# Altium schematic sheet mcu.SchDoc: MCU (STM32G474VET6)
size A3; Revision: 1.0.0; SheetNumber: 7; SheetTotal: 10
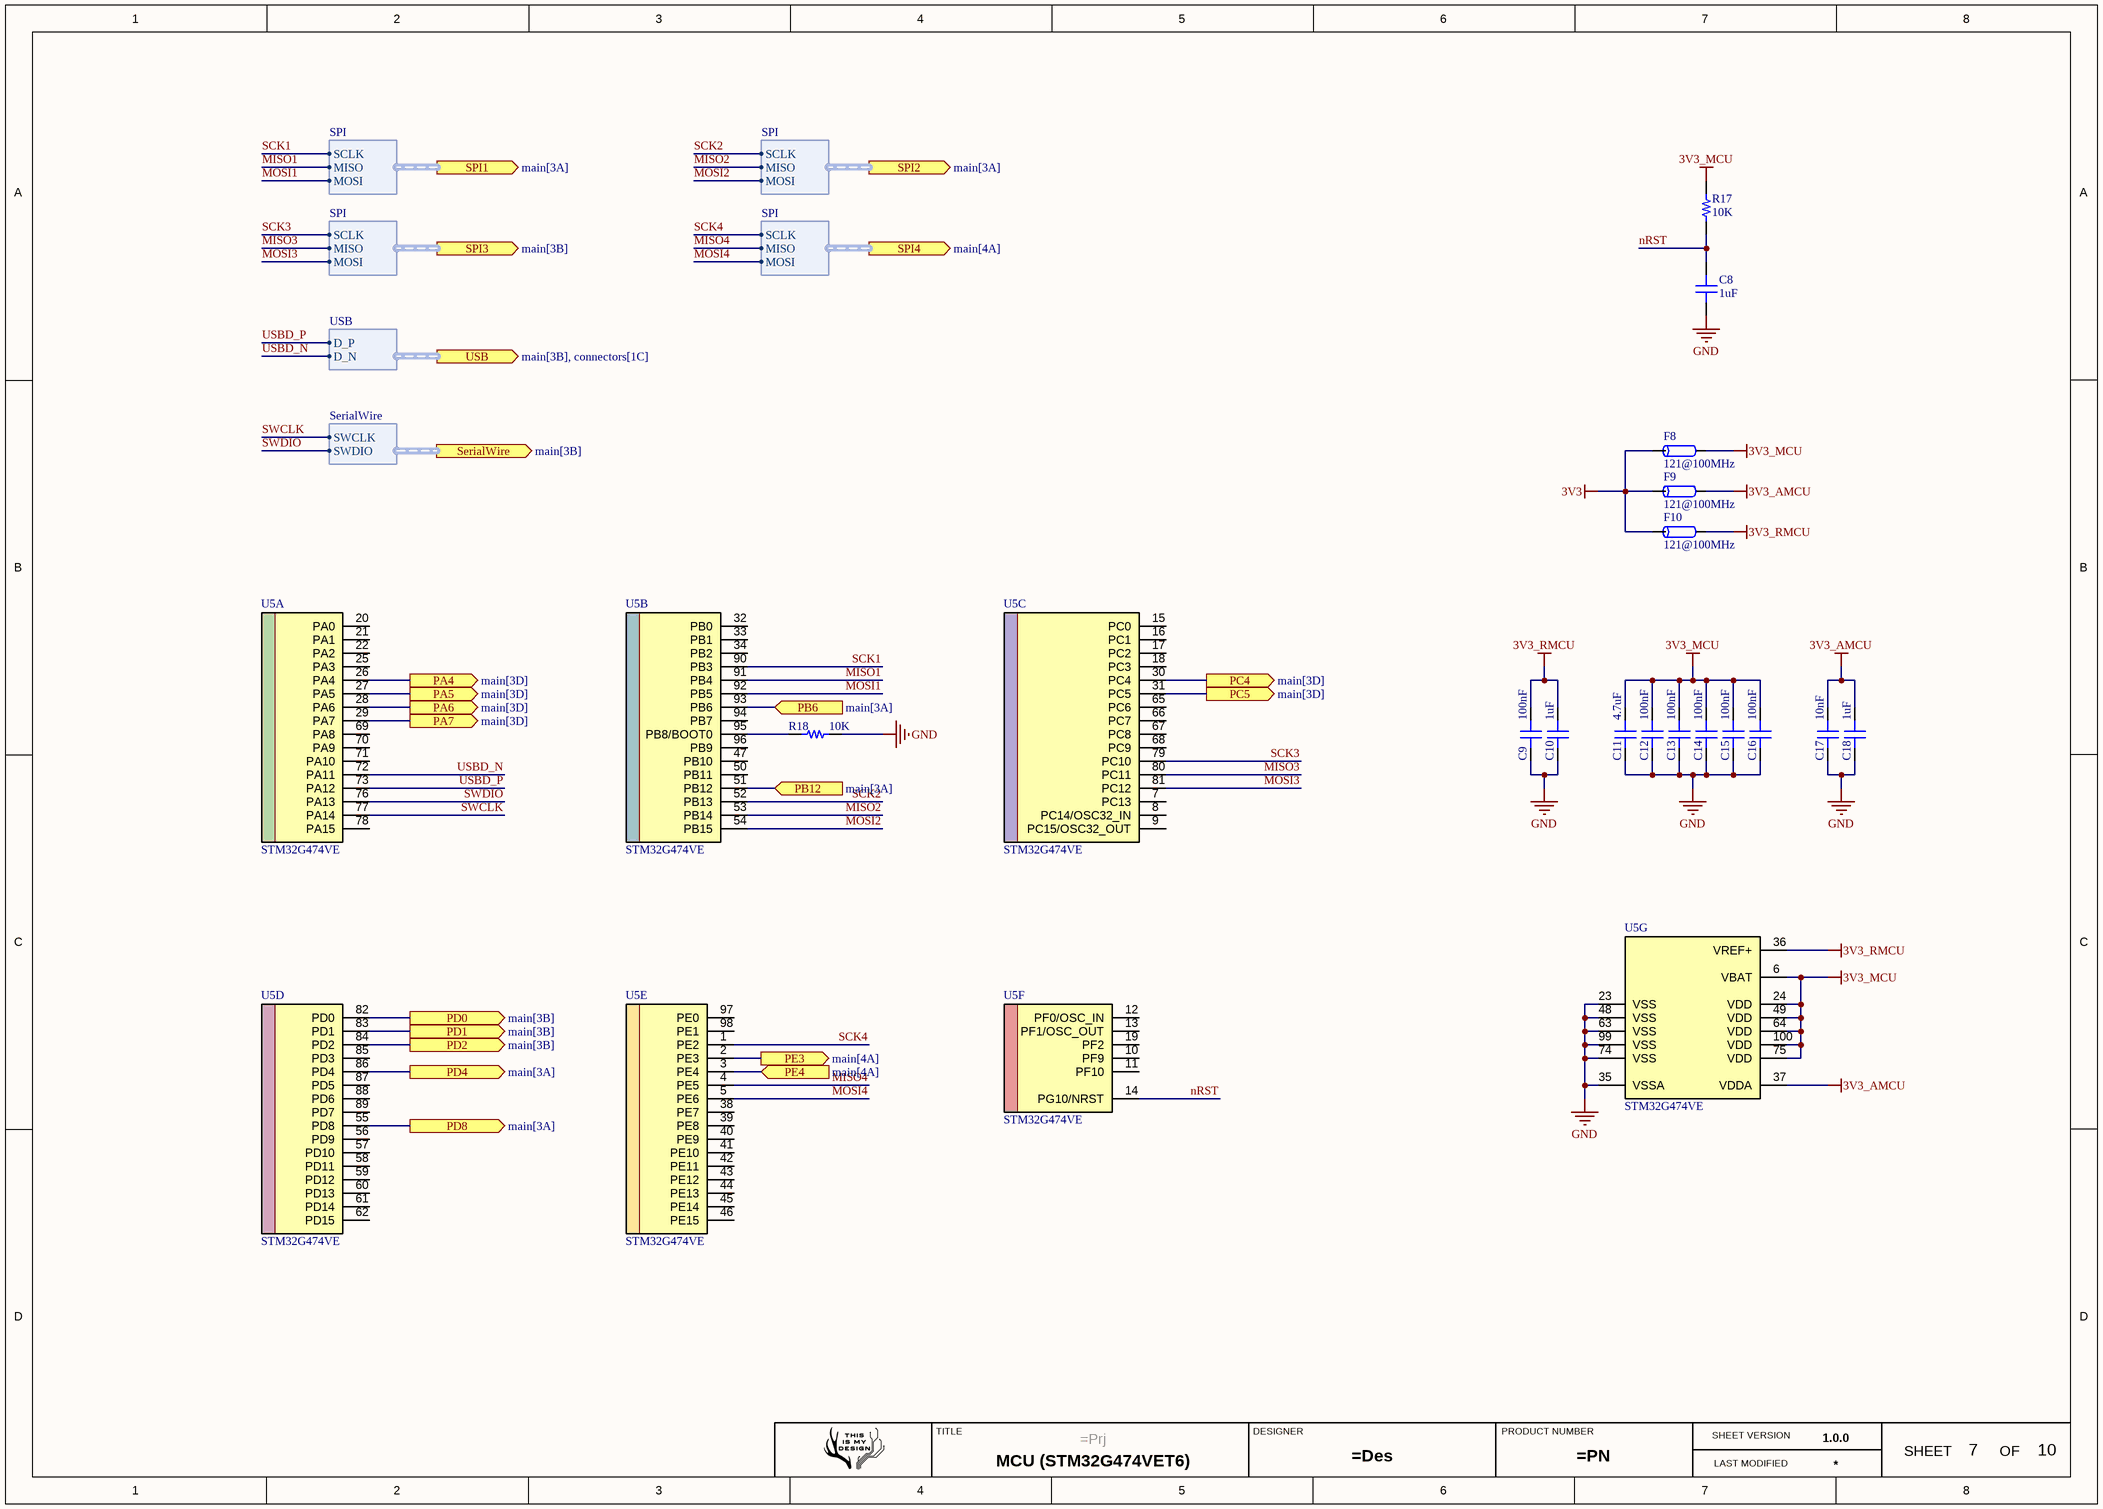
[diagram p0: mcu.SchDoc]

## Parts
C8  1uF  [CAP 0603_1608]
C9  100nF  [CAP 0603_1608]
C10  1uF  [CAP 0603_1608]
C11  4.7uF  [CAP 0805_2012]
C12  100nF  [CAP 0603_1608]
C13  100nF  [CAP 0603_1608]
C14  100nF  [CAP 0603_1608]
C15  100nF  [CAP 0603_1608]
C16  100nF  [CAP 0603_1608]
C17  10nF  [CAP 0603_1608]
C18  1uF  [CAP 0603_1608]
F8  121@100MHz  [Ferrite-0805]
F9  121@100MHz  [Ferrite-0805]
F10  121@100MHz  [Ferrite-0805]
R17  10K  [RES 0603_1608]
R18  10K  [RES 0402_1005]
U5  STM32G474VE  [LQFP100]  (parts A,B,C,D,E,F,G of 7)

## Ports
PA4 (out, see main[3D]), PA5 (out, see main[3D]), PA6 (out, see main[3D]), PA7 (out, see main[3D]), PB6 (in, see main[3A]), PB12 (in, see main[3A]), PC4 (out, see main[3D]), PC5 (out, see main[3D]), PD0 (out, see main[3B]), PD1 (out, see main[3B]), PD2 (out, see main[3B]), PD4 (out, see main[3A]), PD8 (out, see main[3A]), PE3 (out, see main[4A]), PE4 (in, see main[4A]), SerialWire (out, harness SerialWire, see main[3B]), SPI1 (out, harness SPI, see main[3A]), SPI2 (out, harness SPI, see main[3A]), SPI3 (out, harness SPI, see main[3B]), SPI4 (out, harness SPI, see main[4A]), USB (out, harness USB, see main[3B], connectors[1C])

## Harnesses
SPI: SCLK, MISO, MOSI
USB: D_P, D_N
SerialWire: SWCLK, SWDIO

## Nets
3V3: F8.2 F9.2 F10.2
3V3_AMCU: C17.2 C18.2 F9.1 U5.37(VDDA)
3V3_MCU: C11.2 C12.2 C13.2 C14.2 C15.2 C16.2 F8.1 R17.2 U5.6(VBAT) U5.24(VDD) U5.49(VDD) U5.64(VDD) U5.75(VDD) U5.100(VDD)
3V3_RMCU: C9.2 C10.2 F10.1 U5.36(VREF+)
GND: C8.1 C9.1 C10.1 C11.1 C12.1 C13.1 C14.1 C15.1 C16.1 C17.1 C18.1 R18.2 U5.23(VSS) U5.35(VSSA) U5.48(VSS) U5.63(VSS) U5.74(VSS) U5.99(VSS)
MISO1: U5.91(PB4) ; port SPI1.MISO
MISO2: U5.53(PB14) ; port SPI2.MISO
MISO3: U5.80(PC11) ; port SPI3.MISO
MISO4: U5.4(PE5) ; port SPI4.MISO
MOSI1: U5.92(PB5) ; port SPI1.MOSI
MOSI2: U5.54(PB15) ; port SPI2.MOSI
MOSI3: U5.81(PC12) ; port SPI3.MOSI
MOSI4: U5.5(PE6) ; port SPI4.MOSI
nRST: C8.2 R17.1 U5.14(PG10/NRST)
PA4: U5.26(PA4) ; port PA4
PA5: U5.27(PA5) ; port PA5
PA6: U5.28(PA6) ; port PA6
PA7: U5.29(PA7) ; port PA7
PB6: U5.93(PB6) ; port PB6
PB12: U5.51(PB12) ; port PB12
PC4: U5.30(PC4) ; port PC4
PC5: U5.31(PC5) ; port PC5
PD0: U5.82(PD0) ; port PD0
PD1: U5.83(PD1) ; port PD1
PD2: U5.84(PD2) ; port PD2
PD4: U5.86(PD4) ; port PD4
PD8: U5.55(PD8) ; port PD8
PE3: U5.2(PE3) ; port PE3
PE4: U5.3(PE4) ; port PE4
SCK1: U5.90(PB3) ; port SPI1.SCLK
SCK2: U5.52(PB13) ; port SPI2.SCLK
SCK3: U5.79(PC10) ; port SPI3.SCLK
SCK4: U5.1(PE2) ; port SPI4.SCLK
SWCLK: U5.77(PA14) ; port SerialWire.SWCLK
SWDIO: U5.76(PA13) ; port SerialWire.SWDIO
USBD_N: U5.72(PA11) ; port USB.D_N
USBD_P: U5.73(PA12) ; port USB.D_P
NetR18_1: R18.1 U5.95(PB8/BOOT0)

Not connected (* = marked no-connect by the designer): U5 7(PC13) 8(PC14/OSC32_IN) 9(PC15/OSC32_OUT) 10(PF9) 11(PF10) 12(PF0/OSC_IN) 13(PF1/OSC_OUT) 15(PC0) 16(PC1) 17(PC2) 18(PC3) 19(PF2) 20(PA0) 21(PA1) 22(PA2) 25(PA3) 32(PB0) 33(PB1) 34(PB2) 38(PE7) 39(PE8) 40(PE9) 41(PE10) 42(PE11) 43(PE12) 44(PE13) 45(PE14) 46(PE15) 47(PB10) 50(PB11) 56(PD9) 57(PD10) 58(PD11) 59(PD12) 60(PD13) 61(PD14) 62(PD15) 65(PC6) 66(PC7) 67(PC8) 68(PC9) 69(PA8) 70(PA9) 71(PA10) 78(PA15) 85(PD3) 87(PD5) 88(PD6) 89(PD7) 94(PB7) 96(PB9) 97(PE0) 98(PE1)

## Notes on the sheet
- TITLE
- DESIGNER
- PRODUCT NUMBER
- SHEET VERSION
- LAST MODIFIED
- SHEET
- OF

## Library data of the parts
C8-C10 C12-C18 = Cap 0603: SMT Capacitor
  C8 C10 C18: VALUE: 1uF
  C9 C12-C16: VALUE: 100nF
  C17: VALUE: 10nF
C11 = Cap 0805: SMT Capacitor; VALUE: 4.7uF
F8-F10 = Ferrite Bead
R17 = Res 0603: SMT Resistor; VALUE: 10K
R18 = Res 0402: SMT Resistor; VALUE: 10K
U5 = STM32G474VE: Mainstream Arm Cortex-M4 MCU 170 MHz with 512 Kbytes of Flash memory, Math Accelerator, HR Timer, High Analog level integration